# EAGLE design p7.1_3v3 (EAGLE 9.3.0)
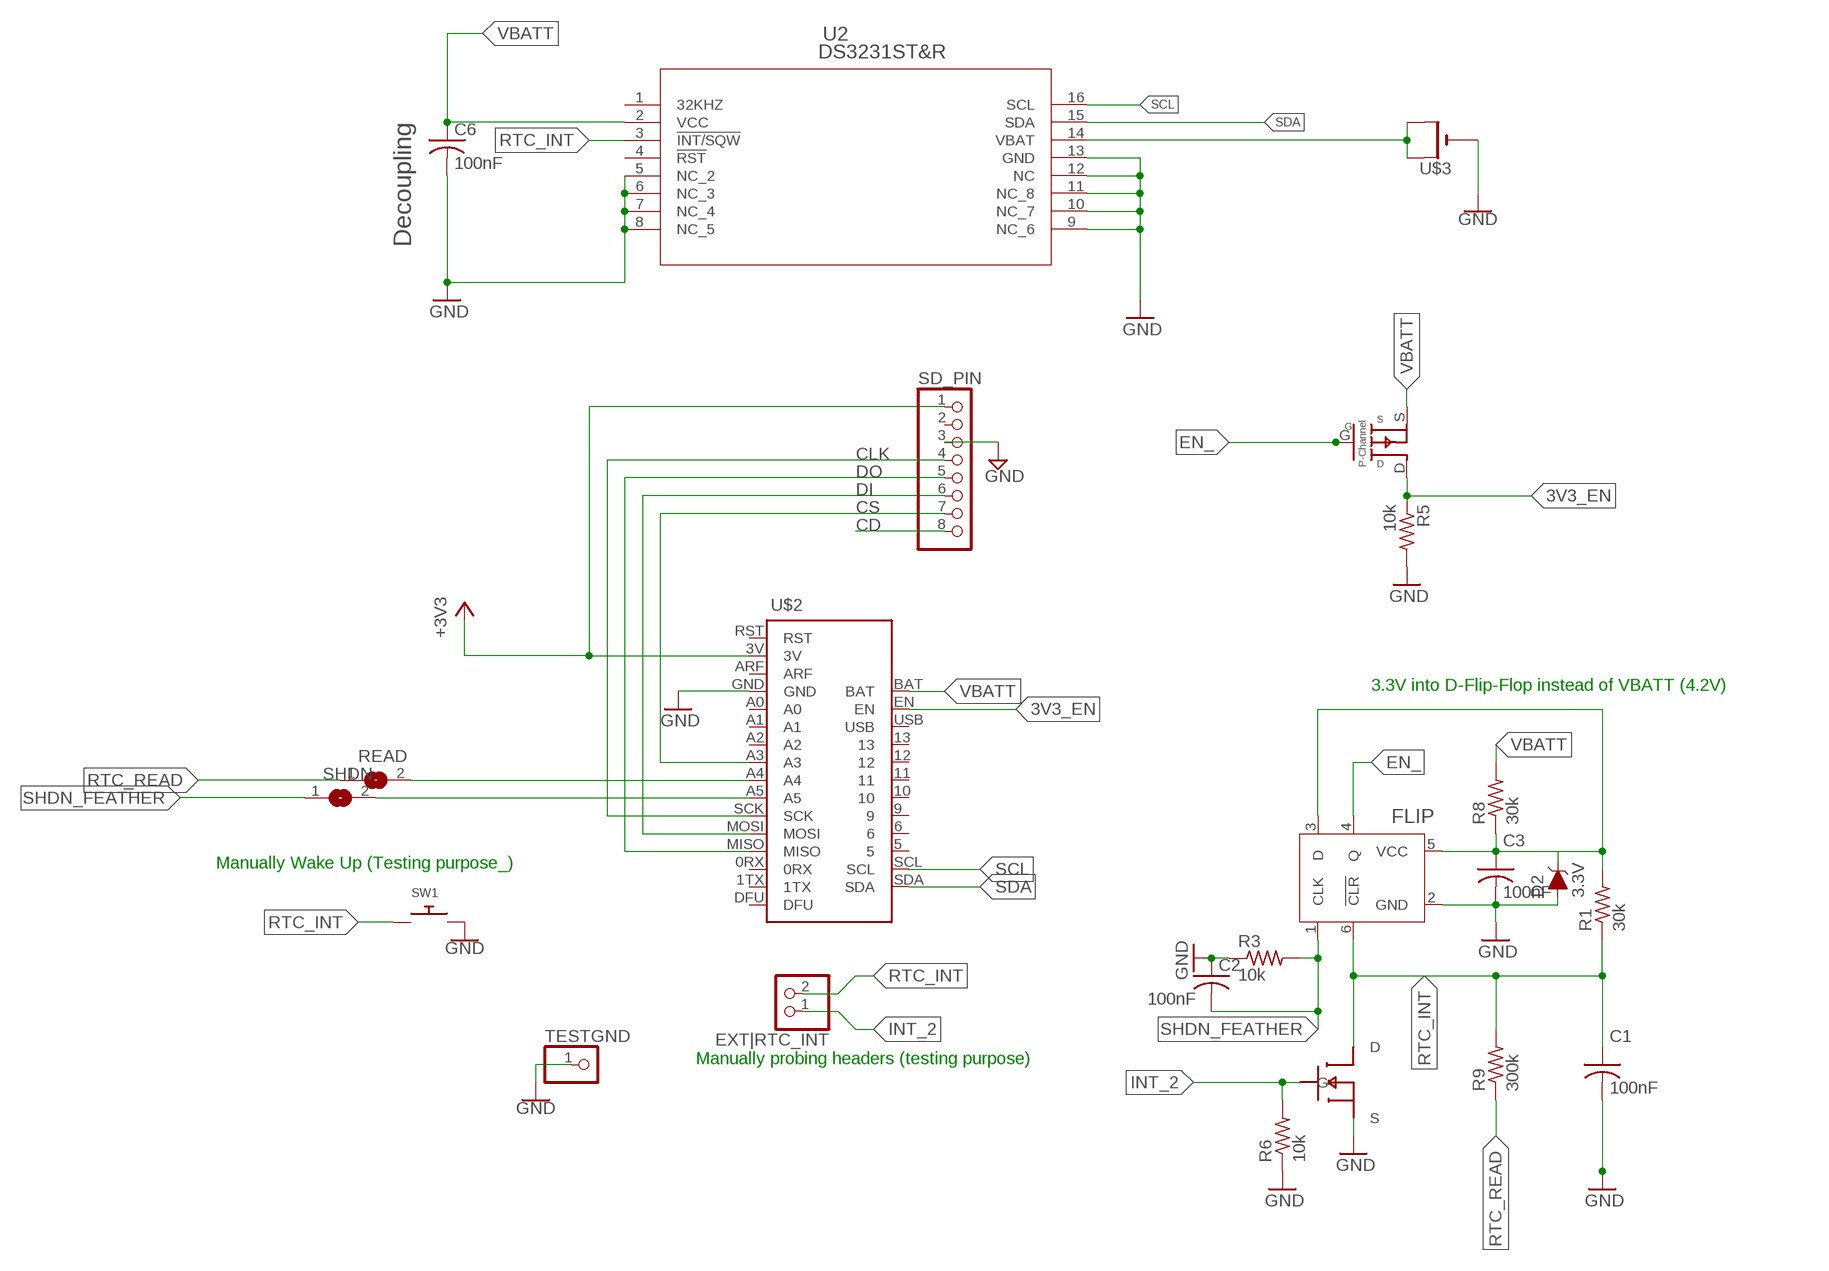
[diagram p0: schematic, sheet 1]

## Parts
C1  100nF  C-USC1206  [C1206]
C2  100nF  C-USC1206  [C1206]
C3  100nF  C-USC1206  [C1206]
C6  100nF  C-USC1206  [C1206]
D2  3.3V  DIODE-ZENER-MM3Z3V3T1G  [SOD-323]
EXT|RTC_INT  PINHD-1X2  [1X02]
FLIP  SN74LVC1G175DBVR  [DBV6]
PMOS  MOSFET-SOT23F  [SOT-23F]
Q2  SSM3J3228R  [SOT-23-3]
R1  30k  R-US_R1206  [R1206]
R3  10k  R-US_R1206  [R1206]
R5  10k  R-US_R1206  [R1206]
R6  10k  R-US_R1206  [R1206]
R8  30k  R-US_R1206  [R1206]
R9  300k  R-US_R1206  [R1206]
READ  SJ  [SJ]
SD_PIN  PINHD-1X8BIG  [1X08-BIG]
SHDN  SJ  [SJ]
SW1  SWITCH_PUSHBUTTONSOFTTOUCHSMD_SJ  [PUSHBUTTON_SMD_SJ]
TESTGND  PINHD-1X1  [1X01]
U2  DS3231ST&R  [21-0042B_16]
U$2  BLUEFRUIT_M0  [BLUEFRUIT_MO]
U$3  CR1220SMT  [CR1220-SMD]

## Nets
3V3_EN: Q2.D R5.1 U$2.EN
+3V3: SD_PIN.1 U$2.3V
CD: SD_PIN.8
CLK: SD_PIN.4 U$2.SCK
CS: SD_PIN.7 U$2.A3
DI: SD_PIN.6 U$2.MOSI
DO: SD_PIN.5 U$2.MISO
EN_: FLIP.4(Q) Q2.G
GND: C2.1 C3.2 C6.2 D2.A FLIP.2(GND) PMOS.S R3.1 R5.2 R6.1 SD_PIN.3 SW1.P$2 TESTGND.1 U2.5(NC_2) U2.6(NC_3) U2.7(NC_4) U2.8(NC_5) U2.9(NC_6) U2.10(NC_7) U2.11(NC_8) U2.12(NC) U2.13(GND) U$2.GND U$3.-
INT_2: EXT|RTC_INT.1 PMOS.G R6.2
N$1: C1.2
N$2: U2.14(VBAT) U$3.+$1(+) U$3.+$2(+1)
N$4: SHDN.2 U$2.A5
N$5: READ.2 U$2.A4
N$6 [sig]: C3.1 D2.C FLIP.3(D) FLIP.5(VCC) R1.2 R8.1
RTC_INT [sig]: C1.1 EXT|RTC_INT.2 FLIP.6(!CLR) PMOS.D R1.1 R9.2 SW1.P$1 U2.3(!INT/SQW)
RTC_READ [sig]: R9.1 READ.1
SCL: U2.16(SCL) U$2.SCL
SDA: U2.15(SDA) U$2.SDA
SHDN_FEATHER [sig]: C2.2 FLIP.1(CLK) R3.2 SHDN.1
VBATT [sig]: C6.1 Q2.S R8.2 U2.2(VCC) U$2.BAT
Unconnected: SD_PIN.2 U2.1(32KHZ) U2.4(!RST) U$2.0RX U$2.1TX U$2.5 U$2.6 U$2.9 U$2.10 U$2.11 U$2.12 U$2.13 U$2.A0 U$2.A1 U$2.A2 U$2.ARF U$2.DFU U$2.RST U$2.USB

## Notes on the sheet
- Decoupling
- 3.3V into D-Flip-Flop instead of VBATT (4.2V)
- Manually Wake Up (Testing purpose_)
- Manually probing headers (testing purpose)

## Library data of the parts
C1 C3 = BOARD2.1FEATHER:C-US: CAPACITOR, American symbol
C2 C6 = adafruit:C-US: CAPACITOR, American symbol
D2 = SparkFun-DiscreteSemi:DIODE-ZENER: Zener Diode A Zener diode allows current to flow from its anode to its cathode like a normal semiconductor diode, but it also permits current to flow in the reverse direction when its "Zener voltage" is reached. - WIkipedia; PROD_ID: DIO-11284
EXT|RTC_INT = pinhead:PINHD-1X2: PIN HEADER
FLIP = eDNA:SN74LVC1G175DBVR: D Flipflop with clear - https://www.digikey.com/product-detail/en/texas-instruments/SN74LVC1G175DBVR/296-17617-1-ND/706599; MANUFACTURER_PART_NUMBER: SN74LVC1G175DBVR; VENDOR: Texas Instruments
PMOS = beach:MOSFET-SOT23F
Q2 = M0_Power:SSM3J3228R: P-Channel MOSFET, SOT-23-3 SMD Package
R1 R3 R5 R6 R9 = adafruit:R-US_: RESISTOR, American symbol
R8 = BOARD2.1FEATHER:R-US_: RESISTOR, American symbol
READ SHDN = jumper:SJ: SMD solder JUMPER
SD_PIN = adafruit:PINHD-1X8: PIN HEADER
SW1 = adafruit:SWITCH_PUSHBUTTON: Buttons SOFTTOUCHSMD_SJ - Soft touch temporary push button (Super Junk Akihabara) Compatible with SKPMANE010 [Mouser: 688-SKPMAN] C&K_KSS = Digikey: KSS221GLFS
TESTGND = adafruitmodified:PINHD-1X1: Pin header 1x1 for 0.1" spacing With round pins
U2 = power8:DS3231ST&R: DS3231 RTC IC only; MANUFACTURER_PART_NUMBER: DS3231S#T&R; VENDOR: Maxim Integrated Products
U$2 = bluefruit_m0:BLUEFRUIT_M0: Adafruit's M0 Bluefruit / Bluetooth board layout
U$3 = adafruit:CR1220: CR1216/CR1220/CR1225 12mm 3V lithium coin cell Great for battery packup. Both SMT and THM holders. Note the THM package has the ground pads on both sides of the PCB so that the masks are the same - this reduces the cost

## Net classes
3 sig: width 0.152 mm, clearance 0.152 mm

## Board
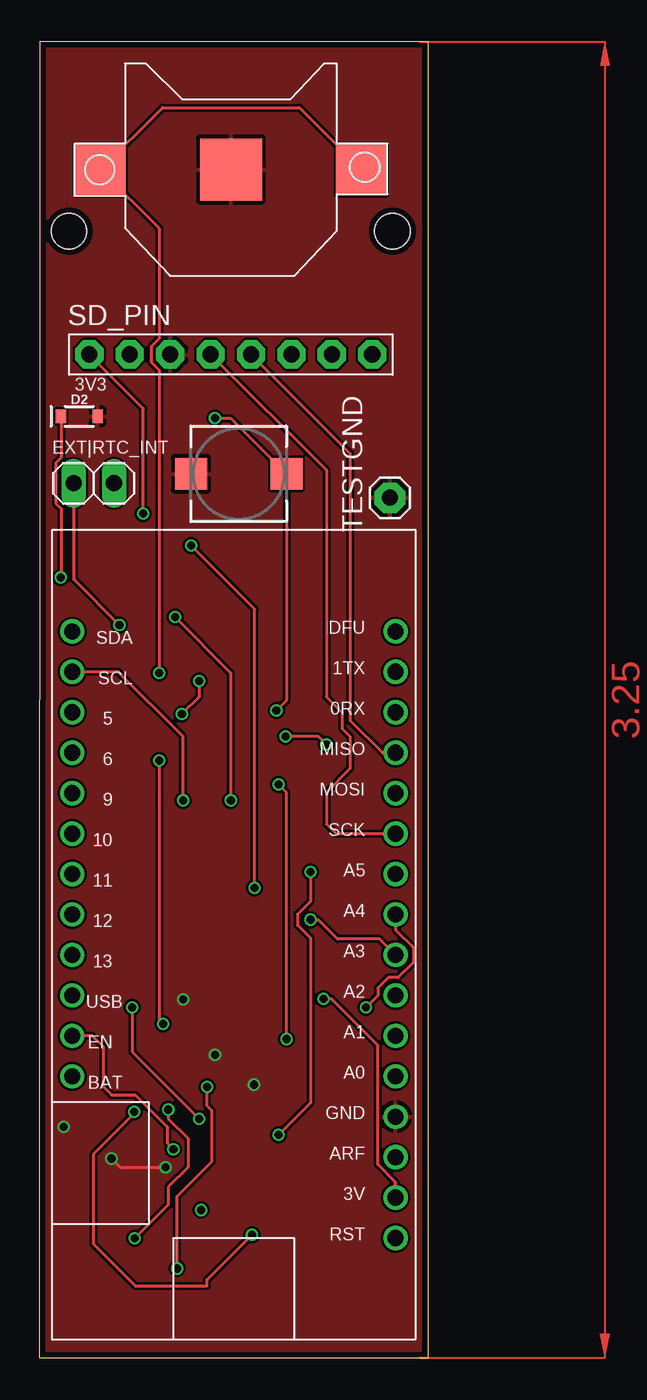
[diagram p1: board, top side]
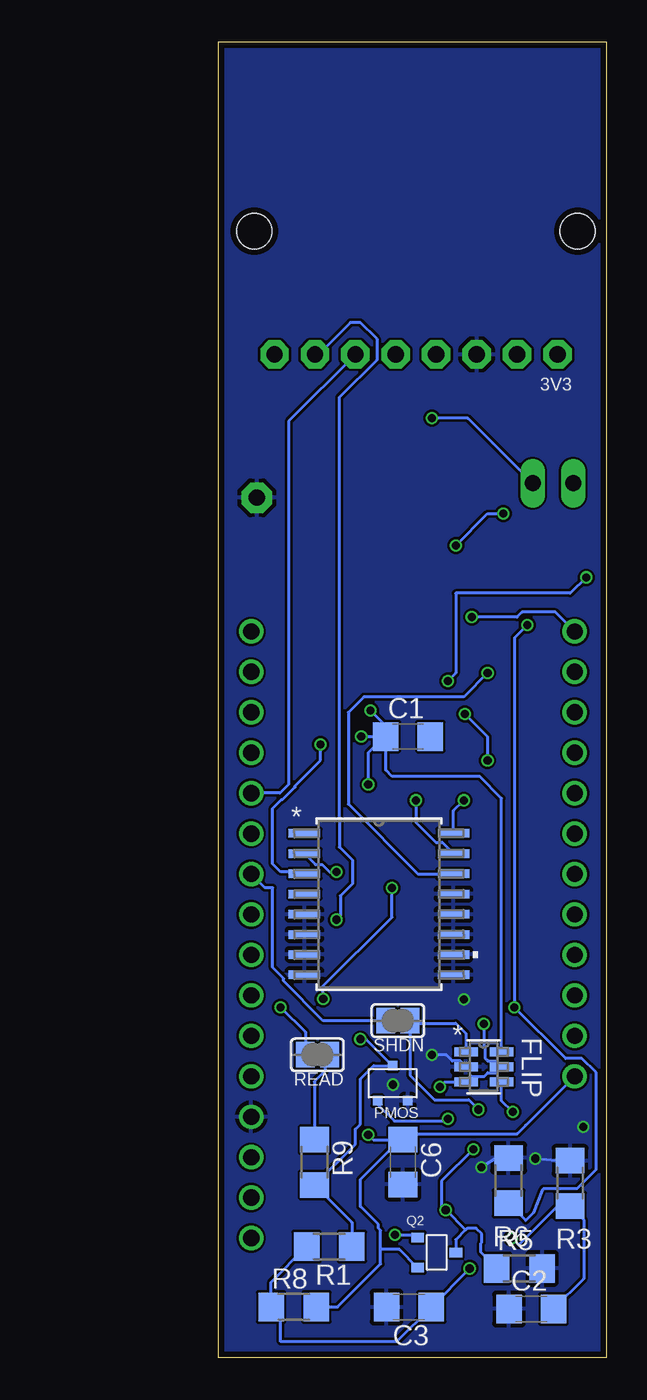
[diagram p2: board, bottom side, seen from below]

Size 24.41 x 82.63 mm. Coordinates in mm from the lower left corner, seen from the top.
Outline: 0,0 24.41,0 24.41,82.63 0.01,82.63
Outline: 0.01,0 0.01,82.63
Copper layers (1*16): Top 0.035559375mm / dielectric 1.6mm / Bottom 0.035559375mm
Design rules "oshpark-2layer": minimum track width 6mil, minimum drill 10mil, track to track 6mil, track to pad 6mil, pad to pad 6mil, via to via 6mil, smd to smd 6mil, copper to edge 15mil, drill to drill 6mil, minimum pad ring 5mil, minimum via ring 5mil, stop-mask expansion 2.5mil, vias tented up to drill 0mil, thermal gap 10mil
Holes 2.2 mm at 22.16,70.74 1.84,70.74

### Footprints (pad centres in the part's own frame; a part is rotated, then mirrored left to right if it is on the bottom)
C1206 = smd 1.6 x 1.8: 1 -1.4,0; 2 1.4,0
SOD-323 = smd 0.63 x 0.83: A 1.15,0; C -1.15,0
1X02 = drill 1.016 long: 1 -1.27,0; 2 1.27,0
DBV6 = smd 1.473 x 0.559: 1 -1.118,0.95; 2 -1.118,0; 3 -1.118,-0.95; 4 1.118,-0.95; 5 1.118,0; 6 1.118,0.95
SOT-23F = smd 0.6 x 0.6: D 0,1.1; G -0.95,-1.1; S 0.95,-1.1
SOT-23-3 = smd 0.8 x 0.6: D 1.2,0; G -1.2,0.95; S -1.2,-0.95
R1206 = smd 1.6 x 1.803: 1 -1.422,0; 2 1.422,0
SJ = smd 1.168 x 1.6: 1 -0.762,0; 2 0.762,0
1X08-BIG = drill 1.016 pad 1.778 octagon: 1 -8.89,0; 2 -6.35,0; 3 -3.81,0; 4 -1.27,0; 5 1.27,0; 6 3.81,0; 7 6.35,0; 8 8.89,0
PUSHBUTTON_SMD_SJ = smd 2 x 2: P$1 3,0; P$2 -3,0
1X01 = drill 1.016 pad 1.93 octagon: 1 0,0
21-0042B_16 = smd 1.981 x 0.533: 1 -4.686,4.445; 2 -4.686,3.175; 3 -4.686,1.905; 4 -4.686,0.635; 5 -4.686,-0.635; 6 -4.686,-1.905; 7 -4.686,-3.175; 8 -4.686,-4.445; 9 4.686,-4.445; 10 4.686,-3.175; 11 4.686,-1.905; 12 4.686,-0.635; 13 4.686,0.635; 14 4.686,1.905; 15 4.686,3.175; 16 4.686,4.445
BLUEFRUIT_MO = drill 1.016: 0RX 39.37,1.27; 1TX 41.91,1.27; 3V 8.89,1.27; 5 39.37,21.59; 6 36.83,21.59; 9 34.29,21.59; 10 31.75,21.59; 11 29.21,21.59; 12 26.67,21.59; 13 24.13,21.59; A0 16.51,1.27; A1 19.05,1.27; A2 21.59,1.27; A3 24.13,1.27; A4 26.67,1.27; A5 29.21,1.27; ARF 11.43,1.27; BAT 16.51,21.59; DFU 44.45,1.27; EN 19.05,21.59; GND 13.97,1.27; MISO 36.83,1.27; MOSI 34.29,1.27; RST 6.35,1.27; SCK 31.75,1.27; SCL 41.91,21.59; SDA 44.45,21.59; USB 21.59,21.59
CR1220-SMD = smd 3.2 x 3.2: +$1 -8.2,0; +$2 8.2,0 | smd 3.9 x 3.9: - 0,0

### Placement (x,y rotation side)
C1  12.5,39 0 bottom
C2  4.76,3.05 0 bottom
C3  12.45,3.17 180 bottom
C6  12.82,12.28 270 bottom
D2  2.48,59.11 0 top
EXT|RTC_INT  3.39,54.91 0 top
FLIP  7.74,18.26 0 bottom
PMOS  13.47,17.23 0 bottom
Q2  10.7,6.6 0 bottom
R1  17.45,6.97 180 bottom
R3  2.32,10.94 270 bottom
R5  5.5,5.6 0 bottom
R6  6.18,11.11 270 bottom
R8  19.68,3.18 0 bottom
R9  18.38,12.26 270 bottom
READ  18.19,19.02 180 bottom
SD_PIN  12,63 0 top
SHDN  13.14,21.16 180 bottom
SW1  12.5,55.5 0 top
TESTGND  22,54 0 top
U2  14.33,28.48 0 bottom
U$2  23.62,1.16 90 top
U$3  12.01,74.61 0 top

### Tracks (layer width: path | path; a pad name or v marks a point on that pad's centre or on a via)
3V3_EN  (via drill 0.51)
  Top 0.203: U$2.EN 3.29,20.21 4,19.5 4,17 4.5,16.5 6,16.5 8,14.5 8,13.48 v8.39,13.09
  Bottom 0.203: v8.39,13.09 10.39,11.09 10.39,9.52 v10.13,9.27 8.88,8.02 | R5.1 7.92,6.6 7.92,7.18 7.87,7.24 7.87,7.76 8.24,8.13 8.76,8.13 8.88,8.02 | 8.88,8.02 9.5,7.4 Q2.D
+3V3  (via drill 0.51)
  Top 0.203: v17.83,22.54 18.32,22.54 21.23,19.62 21.23,12.12 22.35,11.01 U$2.3V | v13.5,29.5 13.5,47 v9.5,51 | v6.5,53 6.5,59.61 SD_PIN.1
  Bottom 0.203: v17.83,22.54 17.83,23.33 13.5,27.66 v13.5,29.5 | v9.5,51 7.5,53 v6.5,53
CLK
  Top 0.203: SD_PIN.4 18,55.73 18,41.5 19,40.5 19,39.5 19.5,39 19.5,37 18,35.5 18,33.5 18.59,32.91 U$2.SCK
CS  (via drill 0.51)
  Top 0.203: v17,27.5 17.5,27.5 18.71,26.29 21.35,26.29 U$2.A3
  Bottom 0.203: SD_PIN.7 18.13,63 16.13,65.01 15.49,65.01 14.47,63.98 14.47,62.66 16.81,60.31 16.81,34 16.81,33.94 16.81,32.06 16,31.25 16,29.75 16.75,29 16.75,27.75 v17,27.5
DI
  Bottom 0.203: SD_PIN.6 20,58.81 20,36 20.55,35.45 U$2.MOSI
DO
  Top 0.203: SD_PIN.5 19.5,56.77 19.5,40 21.51,37.99 U$2.MISO
EN_  (via drill 0.51)
  Top 0.203: v5.92,15.43 5.92,15.32 3.37,12.76 3.37,7.13 6,4.5 10.5,4.5 10.5,4.89 v13.32,7.72
  Bottom 0.203: v5.92,15.43 6.62,16.12 FLIP.4 | v13.32,7.72 12.07,7.72 Q2.G
GND  (via drill 0.51)
  Top 0.203: v4.5,12.5 5.04,11.96 v7.89,11.96
  Bottom 0.203: FLIP.2 9.22,18.63 9.72,18.63 10.1,19 v11,19 | v4.5,12.5 2.82,12.36 R3.1 | v7.89,11.96 7.86,11.99 6.77,12.66 6.31,12.66 R6.1
  other vias: 1.5,14.5 13.45,17.14 9,22.5
  pour Top: 0,0 0,83 25,83 24.64,0
  pour Bottom: 0,83 25,83 25,0 0,0
INT_2  (via drill 0.51)
  Top 0.203: EXT|RTC_INT.1 2.12,48.88 v5,46 | v5.81,22 5.81,19.19 v10,15
  Bottom 0.203: v5,46 5.81,45.19 v5.81,22 2.59,18.78 1.57,18.78 0.69,17.9 0.69,11.81 1.88,10.62 3.98,10.62 4.05,10.55 4.61,9.1 5.1,8.61 R6.2 | v10,15 10.14,14.86 13.36,14.86 14.42,15.92 PMOS.G
N$2  (via drill 0.51)
  Top 0.203: U$3.+$2 16.31,78.5 7.7,78.5 U$3.+$1 7.5,70.91 7.5,64 7,63.49 7,62.51 7.5,62 v7.5,43
  Bottom 0.203: v7.5,43 9,41.5 15.28,41.5 16.25,40.52 16.25,34.75 11.88,30.39 U2.14
N$4
  Bottom 0.203: SHDN.2 17.83,21.16 20.31,23.64 20.31,23.81 21,24.5 21,29.5 21.49,29.5 U$2.A5
N$5  (via drill 0.51)
  Top 0.203: v20.5,22 21.23,22.73 21.23,23.21 21.89,23.86 22.51,23.86 23.47,24.82 23.47,25.75 22.35,26.87 U$2.A4
  Bottom 0.203: v20.5,22 18.95,20.45 READ.2
N$6  (via drill 0.51)
  Top 0.203: v1.31,49 1.33,49.02 1.33,53.31 1,53.63 1,56.19 1.33,56.51 D2.C | v10,42.5 10,41.5 v8.93,40.42 | v7.5,37.5 7.5,20.96 v7.75,20.96 | v8.63,5.59 8.63,10.13 10.81,12.31 10.81,15.5 10.5,15.81 v10.5,17
  Bottom 0.203: v1.31,49 2.31,48 9.5,48 9.5,43 v10,42.5 | v8.93,40.42 7.5,39 v7.5,37.5 | v7.75,20.96 7.75,19.55 7.66,19.46 7.66,18.8 7.49,18.63 6.99,18.63 FLIP.5 6.99,17.89 7.49,17.89 7.7,17.68 8.49,17.68 FLIP.3 10.19,17.31 v10.5,17 | R1.2 21.1,4.74 R8.1 20.5,2.58 20.5,1 13.22,1 C3.1 v8.63,5.59
RTC_INT  (via drill 0.51)
  Top 0.203: v11,59 12,59 SW1.P$1 15.5,41.28 v14.86,40.64 | v15.5,20 15.5,35.5 v15,36 | v18,38.5 17.5,39 v15.44,39
  Bottom 0.203: FLIP.6 6.62,35.12 8,36.5 13.5,36.5 13.9,36.9 C1.1 14,39 | EXT|RTC_INT.2 8.75,59 v11,59 | R1.1 16.03,8.48 R9.2 15.81,13.41 15.81,14.34 15.5,14.65 15.5,17.5 14.67,18.33 PMOS.D 15.14,20 v15.5,20 | v15,36 15,38 14,39 | 14,39 13.61,39.39 v14.86,40.64 | U2.3 19.13,30.5 20.5,30.5 21,31 21,34.5 20.46,35.04 20.39,35.04 19.59,35.83 19.59,35.91 18,37.5 v18,38.5 | v15.44,39 14,39
RTC_READ
  Bottom 0.203: READ.1 17.72,18.73 17.72,18 18.38,17.33 R9.1
SCL  (via drill 0.51)
  Top 0.203: v9,35 9,39 4.93,43.07 U$2.SCL
  Bottom 0.203: U2.16 9.64,34.36 v9,35
SDA  (via drill 0.51)
  Top 0.203: v8.5,46.5 12,43 v12,35
  Bottom 0.203: v8.5,46.5 5.65,46.5 5.34,46.81 3.24,46.81 U$2.SDA | U2.15 10.34,32.35 10.76,32.35 12,33.59 v12,35
SHDN_FEATHER  (via drill 0.51)
  Top 0.203: v5.97,7.49 8.07,9.6 8.07,10.72 9.31,11.96 9.31,13.76 8.07,15 v8.07,15.57
  Bottom 0.203: FLIP.1 8.86,20.36 9.5,21 12.22,21 SHDN.1 12.38,17.73 10.84,16.19 8.69,16.19 v8.07,15.57 | C2.2 1.46,4.95 1.46,8.66 R3.2 2.42,9.42 3.2,9.42 5.55,7.07 v5.97,7.49
VBATT  (via drill 0.51)
  Top 0.203: v15,14 17,16 17,26.35 16.19,27.16 16.19,27.84 17,28.65 v17,30.5
  Bottom 0.203: U$2.BAT 5.1,14.6 5.64,14.06 12.44,14.06 C6.1 13,13.68 | U2.2 18.32,30.96 17.9,30.96 17.44,30.5 v17,30.5 | v15,14 14.68,13.68 13,13.68 | R8.2 16.93,3.18 14.23,5.88 14.23,6.8 | 13,13.68 15.5,11.18 15.5,9.5 14.37,8.37 14.37,8.12 14.23,7.99 14.23,6.8 | Q2.S 13.05,6.8 14.23,6.8
(copper drawn outside any net)
  shapes: Top area x1

### Text on the board
tPlace: 3V3
bPlace: 3V3